# EasyEDA Pro project ProPrj_MN42_v2_2026-01-12.epro, board MOAR_Board
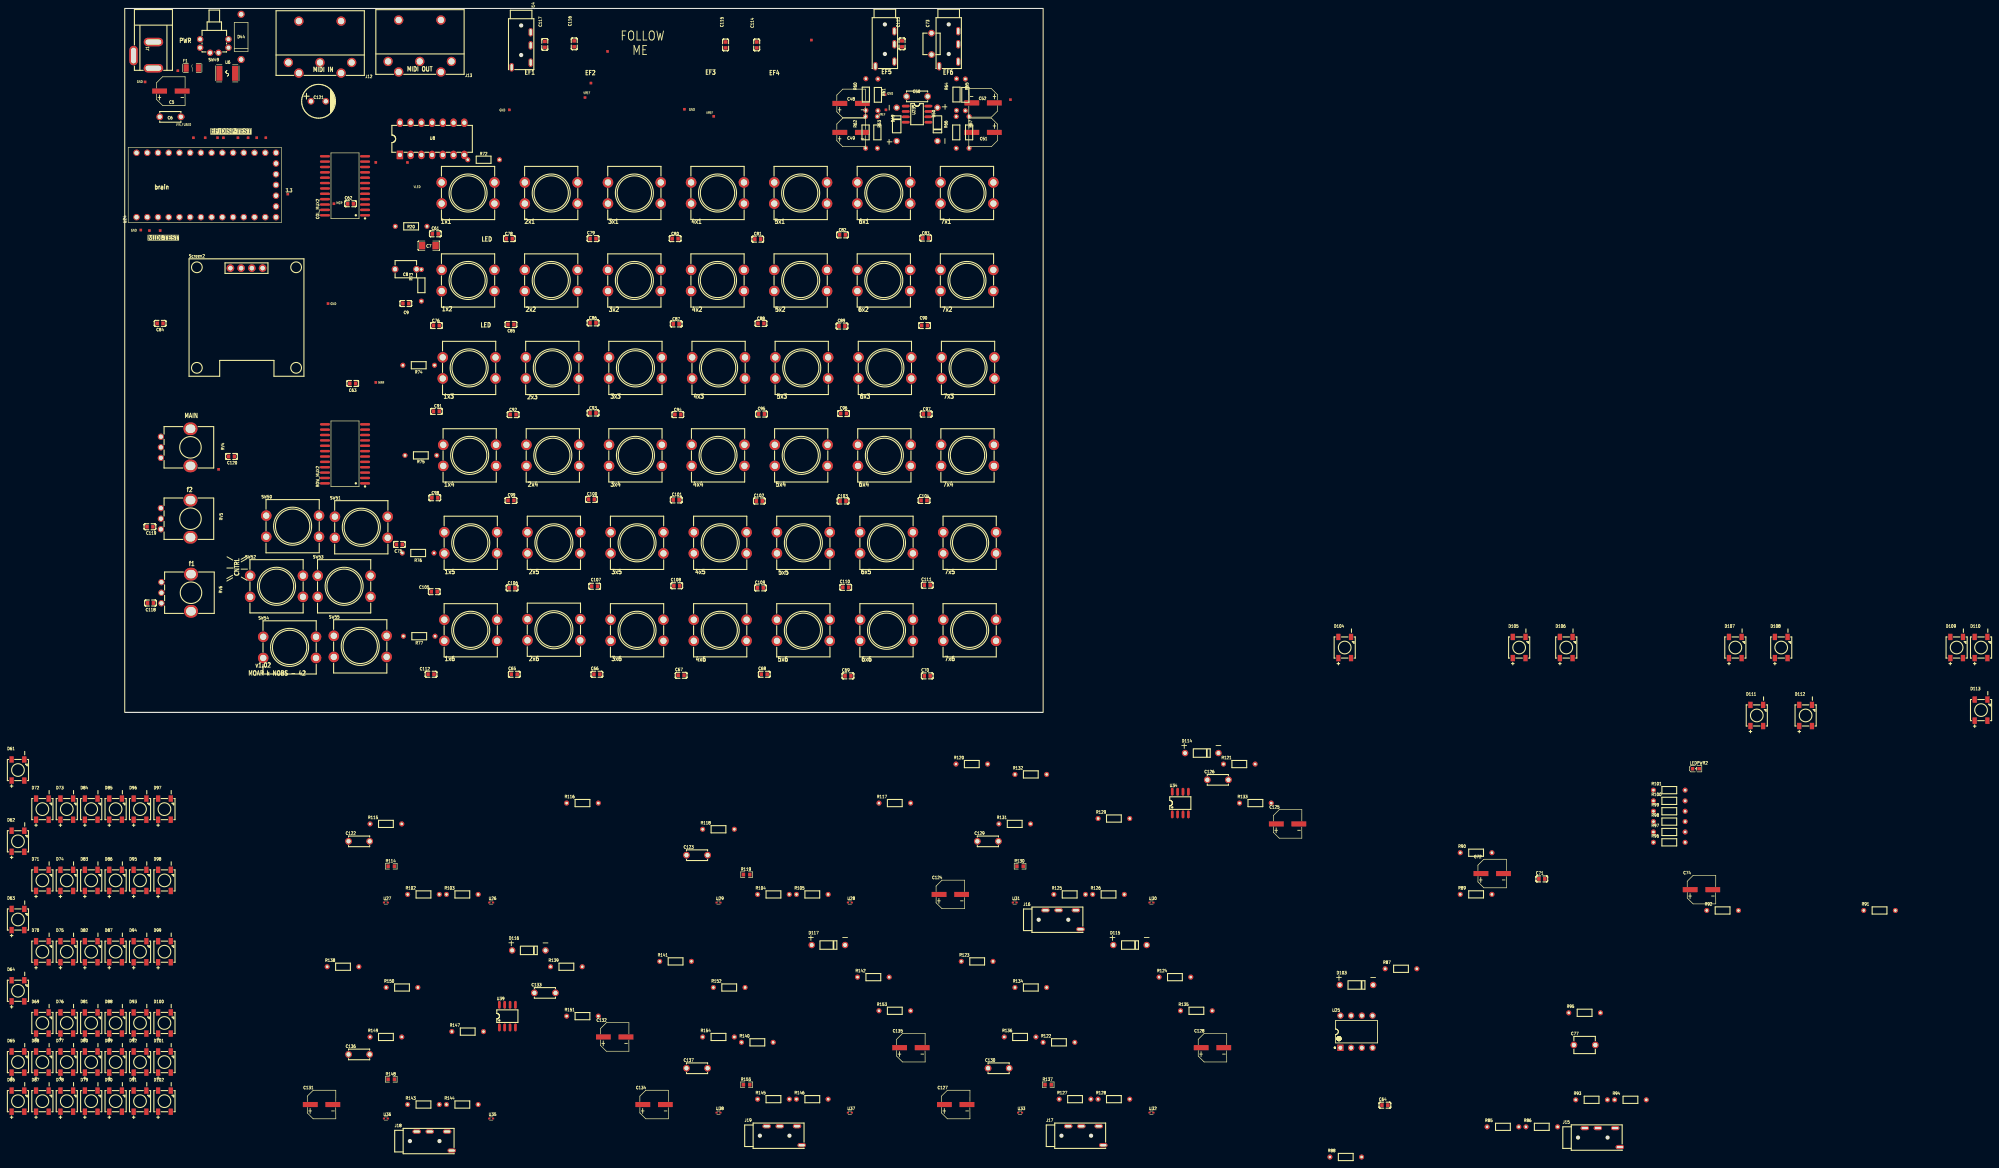
[diagram p3: board, top side]
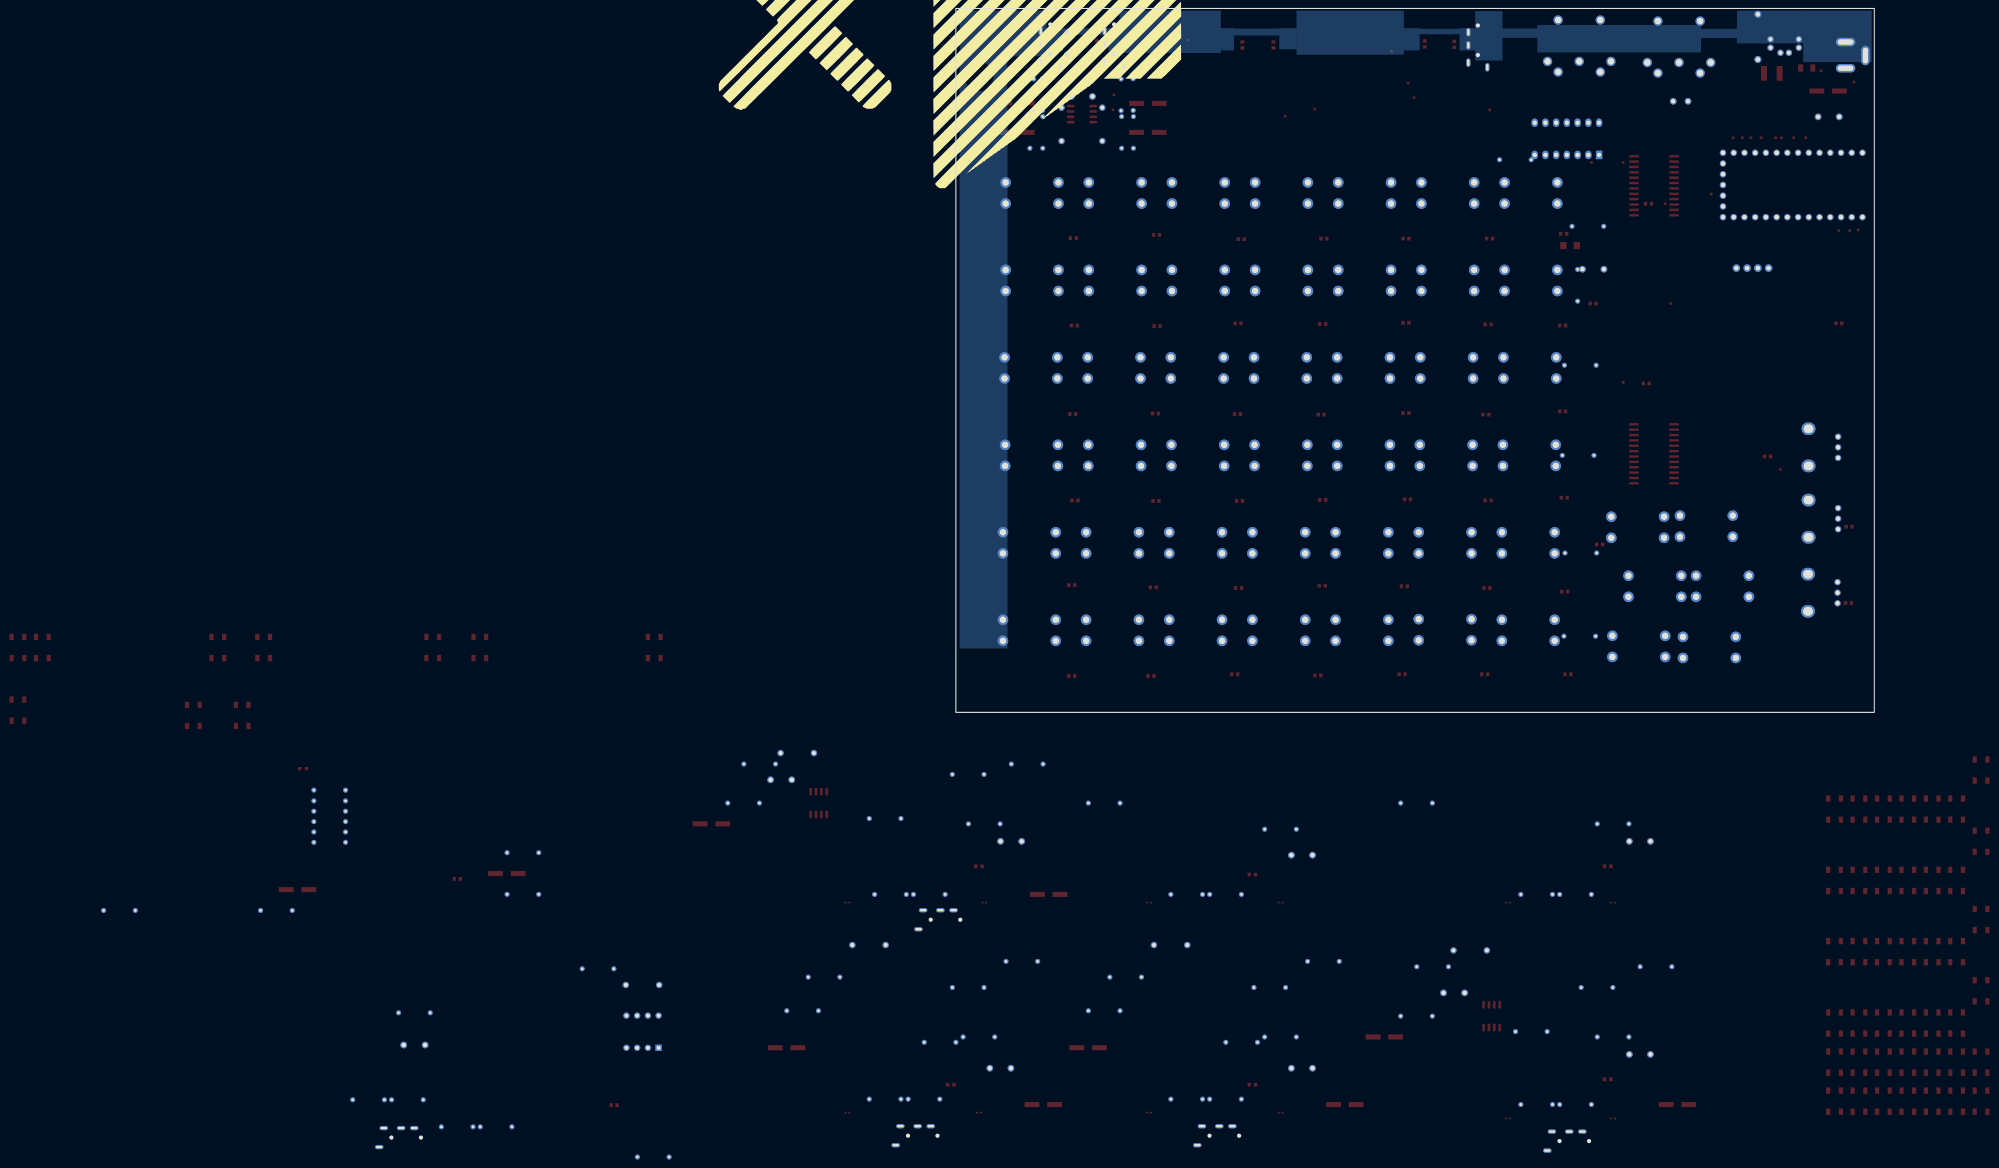
[diagram p4: board, bottom side, seen from below]

Outline 351.54 x 268.6 mm; copper layers: Top Layer, Bottom Layer. Coordinates in mm from the lower left corner of the outline.
Outline path: rectangle 0,268.6 217.42,101.98
Stack: Top Layer 0.035mm / Dielectric1 1.51mm FR4 er 4.5 / Bottom Layer 0.035mm

## Design rules (mm)
template: User Custom Config
spacing safeClearance (default): track to track 0.152, other pairs 0.152 to 0.3
track width trackWidth (default): min 0.152, default 0.254, max 2.54
differential pair differentialPair (default): width min 0.127, default 0.254, max 2.54; gap min 0.152, default 0.152
via viaSize (default): diameter min 0.61, default 0.711, max 10; hole min 0.3, default 0.305, max 5.999

## Placement (name value [footprint] x y rotation side)
C5  220uF  [CAP-SMD_BD6.3-L6.6-W6.6-FD]  10.92 249.04 0 top
C6  100nF  [CAP-TH_L5.0-W2.5-P5.00-D1.0]  10.79 242.95 0 top
C7  100uF  [C1206]  71.99 212.45 0 top
C8  1uF  [CAP-TH_L5.0-W4.0-P5.00-D1.0]  66.55 206.88 180 top
C9  100nF  [C0603]  66.55 198.75 180 top
C48  1uF  [CAP-SMD_BD6.3-L6.6-W6.6-FD]  171.96 246.12 0 top
C49  1uF  [CAP-SMD_BD6.3-L6.6-W6.6-FD]  171.96 239.26 0 top
C50  100nF  [CAP-TH_L5.0-W2.5-P5.00-D1.0]  187.58 247.77 180 top
C51  1uF  [CAP-SMD_BD6.3-L6.6-W6.6-FD]  203.2 239.26 180 top
C52  1uF  [CAP-SMD_BD6.3-L6.6-W6.6-FD]  203.2 246.25 180 top
C61  100nF  [C0603]  73.53 215.26 0 top
C62  100nF  [C0603]  53.47 222.37 0 top
C63  100nF  [C0603]  53.97 179.83 0 top
C64  100nF  [C0603]  298.33 8.99 0 top
C65  100nF  [C0603]  92.22 110.99 0 top
C66  100nF  [C0603]  111.78 110.99 0 top
C67  100nF  [C0603]  131.72 110.74 0 top
C68  100nF  [C0603]  151.41 110.99 0 top
C69  100nF  [C0603]  171.22 110.61 0 top
C70  100nF  [C0603]  189.99 110.61 0 top
C71  100nF  [C0603]  335.47 62.55 0 top
C72  4.7uF  [CAP-SMD_BD6.3-L6.6-W6.6-FD]  323.73 63.82 0 top
C73  1uF  [CAP-TH_L5.0-W4.0-P5.00-D1.0]  191.01 260.22 270 top
C74  10uF  [CAP-SMD_BD6.3-L6.6-W6.6-FD]  373.28 60.01 0 top
C75  100nF  [C0603]  65.02 141.73 0 top
C76  100nF  [C0603]  73.79 193.54 0 top
C77  4.7nF  [CAP-TH_L5.0-W4.0-P5.00-D1.0]  345.61 23.24 0 top
C78  100nF  [C0603]  91.06 214.12 0 top
C79  100nF  [C0603]  110.87 214.12 0 top
C80  100nF  [C0603]  130.3 214.12 180 top
C81  100nF  [C0603]  149.86 213.99 180 top
C82  100nF  [C0603]  169.93 215.01 180 top
C83  100nF  [C0603]  189.61 214.24 180 top
C84  100nF  [C0603]  8.38 194.05 0 top
C85  100nF  [C0603]  91.44 193.8 0 top
C86  100nF  [C0603]  110.87 194.18 0 top
C87  100nF  [C0603]  130.56 193.92 0 top
C88  100nF  [C0603]  150.62 194.05 0 top
C89  100nF  [C0603]  169.8 193.42 0 top
C90  100nF  [C0603]  189.36 193.54 0 top
C91  100nF  [C0603]  73.79 173.22 0 top
C92  100nF  [C0603]  91.95 172.46 0 top
C93  100nF  [C0603]  110.87 172.84 0 top
C94  100nF  [C0603]  130.94 172.46 0 top
C95  100nF  [C0603]  150.75 172.59 0 top
C96  100nF  [C0603]  170.18 172.71 0 top
C97  100nF  [C0603]  189.74 172.59 0 top
C98  100nF  [C0603]  73.41 152.78 0 top
C99  100nF  [C0603]  91.44 152.14 0 top
C100  100nF  [C0603]  110.49 152.39 0 top
C101  100nF  [C0603]  130.56 152.27 0 top
C102  100nF  [C0603]  150.24 152.01 0 top
C103  100nF  [C0603]  170.05 152.01 0 top
C104  100nF  [C0603]  189.23 152.14 0 top
C105  100nF  [C0603]  73.28 130.55 0 top
C106  100nF  [C0603]  91.69 131.44 0 top
C107  100nF  [C0603]  111.25 131.82 0 top
C108  100nF  [C0603]  130.68 131.95 0 top
C109  100nF  [C0603]  150.5 131.44 0 top
C110  100nF  [C0603]  170.69 131.57 0 top
C111  100nF  [C0603]  189.99 132.07 0 top
C112  100nF  [C0603]  72.52 110.99 0 top
C113  100nF  [C0603]  184.02 260.22 270 top
C114  100nF  [C0603]  149.61 259.96 270 top
C115  100nF  [C0603]  142.24 259.96 270 top
C116  100nF  [C0603]  106.43 260.22 270 top
C117  100nF  [C0603]  99.44 260.09 270 top
C118  100nF  [C0603]  6.1 127.86 0 top
C119  100nF  [C0603]  5.97 145.92 0 top
C120  100nF  [C0603]  25.27 162.55 0 top
C121  1000uF  [CAP-TH_BD8.0-P3.50-D0.6-FD]  45.85 246.63 0 top
C122  2.2uF  [CAP-TH_L5.0-W2.5-P5.00-D1.0]  55.49 71.45 0 top
C123  2.2uF  [CAP-TH_L5.0-W2.5-P5.00-D1.0]  135.49 68.18 0 top
C124  1uF  [CAP-SMD_BD6.3-L6.6-W6.6-FD]  195.45 58.88 0 top
C125  1uF  [CAP-SMD_BD6.3-L6.6-W6.6-FD]  275.29 75.57 0 top
C126  100nF  [CAP-TH_L5.0-W2.5-P5.00-D1.0]  258.78 86.02 0 top
C127  1uF  [CAP-SMD_BD6.3-L6.6-W6.6-FD]  196.72 9.15 0 top
C128  1uF  [CAP-SMD_BD6.3-L6.6-W6.6-FD]  257.51 22.6 0 top
C129  2.2uF  [CAP-TH_L5.0-W2.5-P5.00-D1.0]  204.34 71.45 0 top
C130  2.2uF  [CAP-TH_L5.0-W2.5-P5.00-D1.0]  206.88 17.74 0 top
C131  1uF  [CAP-SMD_BD6.3-L6.6-W6.6-FD]  46.6 9.15 0 top
C132  1uF  [CAP-SMD_BD6.3-L6.6-W6.6-FD]  115.99 25.14 0 top
C133  100nF  [CAP-TH_L5.0-W2.5-P5.00-D1.0]  99.48 35.58 0 top
C134  1uF  [CAP-SMD_BD6.3-L6.6-W6.6-FD]  125.33 9.15 0 top
C135  1uF  [CAP-SMD_BD6.3-L6.6-W6.6-FD]  186.11 22.6 0 top
C136  2.2uF  [CAP-TH_L5.0-W2.5-P5.00-D1.0]  55.49 21.01 0 top
C137  2.2uF  [CAP-TH_L5.0-W2.5-P5.00-D1.0]  135.49 17.74 0 top
COL_MUX2  CD74HC4067M96  [SOIC-24_L15.4-W7.5-P1.27-LS10.3-BL]  52.15 226.63 90 top
D44  SA6.0A  [DO-15_BD3.1-L6.7-P10.70-D0.8-RD]  27.56 261.87 90 top
D49  1N4148PF  [DO-35_BD1.9-L3.9-P7.90-D0.5-FD]  182.75 241.17 90 top
D50  1N4148PF  [DO-35_BD1.9-L3.9-P7.90-D0.5-FD]  192.41 241.17 270 top
D61  XL-5050RGBC-WS2812B  [LED-SMD_4P-L5.0-W5.0-BL_XL-5050RGBC]  -25.28 88.33 0 top
D62  XL-5050RGBC-WS2812B  [LED-SMD_4P-L5.0-W5.0-BL_XL-5050RGBC]  -25.28 71.45 0 top
D63  XL-5050RGBC-WS2812B  [LED-SMD_4P-L5.0-W5.0-BL_XL-5050RGBC]  -25.28 52.94 0 top
D64  XL-5050RGBC-WS2812B  [LED-SMD_4P-L5.0-W5.0-BL_XL-5050RGBC]  -25.28 36.07 0 top
D65  XL-5050RGBC-WS2812B  [LED-SMD_4P-L5.0-W5.0-BL_XL-5050RGBC]  -25.28 19.2 0 top
D66  XL-5050RGBC-WS2812B  [LED-SMD_4P-L5.0-W5.0-BL_XL-5050RGBC]  -25.28 9.94 0 top
D67  XL-5050RGBC-WS2812B  [LED-SMD_4P-L5.0-W5.0-BL_XL-5050RGBC]  -19.5 9.94 0 top
D68  XL-5050RGBC-WS2812B  [LED-SMD_4P-L5.0-W5.0-BL_XL-5050RGBC]  -19.5 19.2 0 top
D69  XL-5050RGBC-WS2812B  [LED-SMD_4P-L5.0-W5.0-BL_XL-5050RGBC]  -19.5 28.45 0 top
D70  XL-5050RGBC-WS2812B  [LED-SMD_4P-L5.0-W5.0-BL_XL-5050RGBC]  -19.5 45.32 0 top
D71  XL-5050RGBC-WS2812B  [LED-SMD_4P-L5.0-W5.0-BL_XL-5050RGBC]  -19.5 62.2 0 top
D72  XL-5050RGBC-WS2812B  [LED-SMD_4P-L5.0-W5.0-BL_XL-5050RGBC]  -19.5 79.07 0 top
D73  XL-5050RGBC-WS2812B  [LED-SMD_4P-L5.0-W5.0-BL_XL-5050RGBC]  -13.72 79.07 0 top
D74  XL-5050RGBC-WS2812B  [LED-SMD_4P-L5.0-W5.0-BL_XL-5050RGBC]  -13.72 62.2 0 top
D75  XL-5050RGBC-WS2812B  [LED-SMD_4P-L5.0-W5.0-BL_XL-5050RGBC]  -13.72 45.32 0 top
D76  XL-5050RGBC-WS2812B  [LED-SMD_4P-L5.0-W5.0-BL_XL-5050RGBC]  -13.72 28.45 0 top
D77  XL-5050RGBC-WS2812B  [LED-SMD_4P-L5.0-W5.0-BL_XL-5050RGBC]  -13.72 19.2 0 top
D78  XL-5050RGBC-WS2812B  [LED-SMD_4P-L5.0-W5.0-BL_XL-5050RGBC]  -13.72 9.94 0 top
D79  XL-5050RGBC-WS2812B  [LED-SMD_4P-L5.0-W5.0-BL_XL-5050RGBC]  -7.94 9.94 0 top
D80  XL-5050RGBC-WS2812B  [LED-SMD_4P-L5.0-W5.0-BL_XL-5050RGBC]  -7.94 19.2 0 top
D81  XL-5050RGBC-WS2812B  [LED-SMD_4P-L5.0-W5.0-BL_XL-5050RGBC]  -7.94 28.45 0 top
D82  XL-5050RGBC-WS2812B  [LED-SMD_4P-L5.0-W5.0-BL_XL-5050RGBC]  -7.94 45.32 0 top
D83  XL-5050RGBC-WS2812B  [LED-SMD_4P-L5.0-W5.0-BL_XL-5050RGBC]  -7.94 62.2 0 top
D84  XL-5050RGBC-WS2812B  [LED-SMD_4P-L5.0-W5.0-BL_XL-5050RGBC]  -7.94 79.07 0 top
D85  XL-5050RGBC-WS2812B  [LED-SMD_4P-L5.0-W5.0-BL_XL-5050RGBC]  -2.16 79.07 0 top
D86  XL-5050RGBC-WS2812B  [LED-SMD_4P-L5.0-W5.0-BL_XL-5050RGBC]  -2.16 62.2 0 top
D87  XL-5050RGBC-WS2812B  [LED-SMD_4P-L5.0-W5.0-BL_XL-5050RGBC]  -2.16 45.32 0 top
D88  XL-5050RGBC-WS2812B  [LED-SMD_4P-L5.0-W5.0-BL_XL-5050RGBC]  -2.16 28.45 0 top
D89  XL-5050RGBC-WS2812B  [LED-SMD_4P-L5.0-W5.0-BL_XL-5050RGBC]  -2.16 19.2 0 top
D90  XL-5050RGBC-WS2812B  [LED-SMD_4P-L5.0-W5.0-BL_XL-5050RGBC]  -2.16 9.94 0 top
D91  XL-5050RGBC-WS2812B  [LED-SMD_4P-L5.0-W5.0-BL_XL-5050RGBC]  3.62 9.94 0 top
D92  XL-5050RGBC-WS2812B  [LED-SMD_4P-L5.0-W5.0-BL_XL-5050RGBC]  3.62 19.2 0 top
D93  XL-5050RGBC-WS2812B  [LED-SMD_4P-L5.0-W5.0-BL_XL-5050RGBC]  3.62 28.45 0 top
D94  XL-5050RGBC-WS2812B  [LED-SMD_4P-L5.0-W5.0-BL_XL-5050RGBC]  3.62 45.32 0 top
D95  XL-5050RGBC-WS2812B  [LED-SMD_4P-L5.0-W5.0-BL_XL-5050RGBC]  3.62 62.2 0 top
D96  XL-5050RGBC-WS2812B  [LED-SMD_4P-L5.0-W5.0-BL_XL-5050RGBC]  3.62 79.07 0 top
D97  XL-5050RGBC-WS2812B  [LED-SMD_4P-L5.0-W5.0-BL_XL-5050RGBC]  9.4 79.07 0 top
D98  XL-5050RGBC-WS2812B  [LED-SMD_4P-L5.0-W5.0-BL_XL-5050RGBC]  9.4 62.2 0 top
D99  XL-5050RGBC-WS2812B  [LED-SMD_4P-L5.0-W5.0-BL_XL-5050RGBC]  9.4 45.32 0 top
D100  XL-5050RGBC-WS2812B  [LED-SMD_4P-L5.0-W5.0-BL_XL-5050RGBC]  9.4 28.45 0 top
D101  XL-5050RGBC-WS2812B  [LED-SMD_4P-L5.0-W5.0-BL_XL-5050RGBC]  9.4 19.2 0 top
D102  XL-5050RGBC-WS2812B  [LED-SMD_4P-L5.0-W5.0-BL_XL-5050RGBC]  9.4 9.94 0 top
D103  1N4148PF  [DO-35_BD1.9-L3.9-P7.90-D0.5-FD]  291.6 37.44 0 top
D104  XL-5050RGBC-WS2812B  [LED-SMD_4P-L5.0-W5.0-BL_XL-5050RGBC]  288.82 117.32 0 top
D105  XL-5050RGBC-WS2812B  [LED-SMD_4P-L5.0-W5.0-BL_XL-5050RGBC]  330.11 117.32 0 top
D106  XL-5050RGBC-WS2812B  [LED-SMD_4P-L5.0-W5.0-BL_XL-5050RGBC]  341.26 117.32 0 top
D107  XL-5050RGBC-WS2812B  [LED-SMD_4P-L5.0-W5.0-BL_XL-5050RGBC]  381.29 117.32 0 top
D108  XL-5050RGBC-WS2812B  [LED-SMD_4P-L5.0-W5.0-BL_XL-5050RGBC]  392.15 117.32 0 top
D109  XL-5050RGBC-WS2812B  [LED-SMD_4P-L5.0-W5.0-BL_XL-5050RGBC]  433.68 117.32 0 top
D110  XL-5050RGBC-WS2812B  [LED-SMD_4P-L5.0-W5.0-BL_XL-5050RGBC]  439.46 117.32 0 top
D111  XL-5050RGBC-WS2812B  [LED-SMD_4P-L5.0-W5.0-BL_XL-5050RGBC]  386.37 101.24 0 top
D112  XL-5050RGBC-WS2812B  [LED-SMD_4P-L5.0-W5.0-BL_XL-5050RGBC]  397.93 101.24 0 top
D113  XL-5050RGBC-WS2812B  [LED-SMD_4P-L5.0-W5.0-BL_XL-5050RGBC]  439.46 102.51 0 top
D114  1N4148PF  [DO-35_BD1.9-L3.9-P7.90-D0.5-FD]  254.97 92.34 0 top
D115  1N4148PF  [DO-35_BD1.9-L3.9-P7.90-D0.5-FD]  237.98 46.9 0 top
D116  1N4148PF  [DO-35_BD1.9-L3.9-P7.90-D0.5-FD]  95.67 45.63 0 top
D117  1N4148PF  [DO-35_BD1.9-L3.9-P7.90-D0.5-FD]  166.59 46.9 0 top
F1  nSMD050-33V  [F1206]  16 254.5 0 top
J1  DC005  [DC-IN-TH_DC005]  4.45 257.55 270 top
J8  HC-PJ-320A  [AUDIO-SMD_HC-PJ-320A]  179.96 259.07 270 top
J9  HC-PJ-320A  [AUDIO-SMD_HC-PJ-320A]  195.07 259.07 270 top
J12  DIN-504B-M10  [CONN-TH_DIN-504B-M10]  46.23 259.46 180 top
J13  DIN-504B-M10  [CONN-TH_DIN-504B-M10]  69.85 259.71 180 top
J14  HC-PJ-320A  [AUDIO-SMD_HC-PJ-320A]  93.85 258.82 270 top
J15  HC-PJ-320A  [AUDIO-SMD_HC-PJ-320A]  349.8 1.33 0 top
J16  HC-PJ-320A  [AUDIO-SMD_HC-PJ-320A]  222.12 52.89 0 top
J17  HC-PJ-320A  [AUDIO-SMD_HC-PJ-320A]  227.51 1.77 0 top
J18  HC-PJ-320A  [AUDIO-SMD_HC-PJ-320A]  73.27 0.5 0 top
J19  HC-PJ-320A  [AUDIO-SMD_HC-PJ-320A]  156.12 1.77 0 top
LEDPWR2  -  [LED_0603]  372.01 88.64 0 top
NOREF  -  [Pad_e6019]  19.05 237.99 0 top
NOREF#2  -  [Pad_e371]  114.3 258.44 0 top
NOREF#3  -  [Pad_e726]  132.5 244.74 180 top
NOREF#4  -  [Pad_e954935]  110.36 250.95 0 top
NOREF#5  -  [Pad_e146]  12.57 253.87 0 top
NOREF#6  -  [Pad_e954570]  3.81 216.15 0 top
NOREF#7  -  [Pad_e372]  162.56 261.11 0 top
NOREF#8  -  [Pad_e954937]  59.44 232.15 0 top
NOREF#9  -  [Pad_e222]  108.97 247.52 0 top
NOREF#10  -  [Pad_e236]  59.44 180.08 0 top
NOREF#11  -  [Pad_e6022]  31.24 237.99 0 top
NOREF#12  -  [Pad_e6035]  21.97 237.99 0 top
NOREF#13  -  [Pad_e234]  49.53 222.37 0 top
NOREF#14  -  [Pad_e215]  38.61 224.66 0 top
NOREF#15  -  [Pad_e370]  22.22 159.51 0 top
NOREF#16  -  [Pad_e373]  209.68 247.01 0 top
NOREF#17  -  [Pad_e6015]  8.38 216.02 0 top
NOREF#18  -  [Pad_e6029]  16.26 237.99 0 top
NOREF#19  -  [Pad_e6013]  5.84 216.02 0 top
NOREF#20  -  [Pad_e223]  139.45 243.07 0 top
NOREF#21  -  [Pad_e229]  185.46 247.42 0 top
NOREF#22  -  [Pad_e6017]  66.93 232.15 0 top
NOREF#23  -  [Pad_e6036]  23.37 237.99 0 top
NOREF#24  -  [Pad_e6023]  33.4 237.99 0 top
NOREF#25  -  [Pad_e6020]  26.8 237.99 0 top
NOREF#26  -  [Pad_e730]  180 248.17 180 top
NOREF#27  -  [Pad_e954575]  4.83 251.2 0 top
NOREF#28  -  [Pad_e213]  13.84 242.95 0 top
NOREF#29  -  [Pad_e6021]  29.21 237.99 0 top
NOREF#30  -  [Pad_e724]  91.06 244.6 0 top
NOREF#31  -  [Pad_e954561]  48.13 198.75 0 top
NOREF#32  -  [Pad_e955723]  180.21 244.6 0 top
R20  33Ω  [RES-TH_BD1.7-L3.5-P7.50-D0.5]  67.8 217.02 0 top
R60  100kΩ  [RES-TH_BD1.7-L3.5-P7.50-D0.5]  175.45 248.22 90 top
R61  100kΩ  [RES-TH_BD1.7-L3.5-P7.50-D0.5]  178.31 248.15 90 top
R62  22kΩ  [RES-TH_BD1.7-L3.5-P7.50-D0.5]  175.39 239.26 90 top
R63  10kΩ  [RES-TH_BD1.7-L3.5-P7.50-D0.5]  178.18 239.26 90 top
R64  100kΩ  [RES-TH_BD1.7-L3.5-P7.50-D0.5]  196.91 248.22 90 top
R65  100kΩ  [RES-TH_BD1.7-L3.5-P7.50-D0.5]  199.01 248.15 90 top
R66  22kΩ  [RES-TH_BD1.7-L3.5-P7.50-D0.5]  196.85 239.26 90 top
R67  10kΩ  [RES-TH_BD1.7-L3.5-P7.50-D0.5]  199.9 239.26 90 top
R72  10kΩ  [RES-TH_BD1.7-L3.5-P7.50-D0.5]  84.96 232.79 0 top
R73  10kΩ  [RES-TH_BD1.7-L3.5-P7.50-D0.5]  70.23 203.07 270 top
R74  10kΩ  [RES-TH_BD1.7-L3.5-P7.50-D0.5]  69.6 184.14 0 top
R75  10kΩ  [RES-TH_BD1.7-L3.5-P7.50-D0.5]  70.1 162.81 0 top
R76  10kΩ  [RES-TH_BD1.7-L3.5-P7.50-D0.5]  69.47 139.69 0 top
R77  10kΩ  [RES-TH_BD1.7-L3.5-P7.50-D0.5]  69.72 120.01 0 top
R85  220Ω  [RES-TH_BD1.7-L3.5-P7.50-D0.5]  326.27 3.87 0 top
R86  220Ω  [RES-TH_BD1.7-L3.5-P7.50-D0.5]  335.47 3.87 0 top
R87  220Ω  [RES-TH_BD1.7-L3.5-P7.50-D0.5]  302.14 41.28 0 top
R88  4.7kΩ  [RES-TH_BD1.7-L3.5-P7.50-D0.5]  289.06 -3.28 0 top
R89  100kΩ  [RES-TH_BD1.7-L3.5-P7.50-D0.5]  319.92 58.9 0 top
R90  100kΩ  [RES-TH_BD1.7-L3.5-P7.50-D0.5]  319.92 68.75 0 top
R91  4.7kΩ  [RES-TH_BD1.7-L3.5-P7.50-D0.5]  415.43 55.09 0 top
R92  4.7kΩ  [RES-TH_BD1.7-L3.5-P7.50-D0.5]  378.27 55.09 0 top
R93  220Ω  [RES-TH_BD1.7-L3.5-P7.50-D0.5]  347.26 10.26 0 top
R94  220Ω  [RES-TH_BD1.7-L3.5-P7.50-D0.5]  356.46 10.26 0 top
R95  220Ω  [RES-TH_BD1.7-L3.5-P7.50-D0.5]  345.61 30.86 0 top
R96  220Ω  [RES-TH_BD1.7-L3.5-P7.50-D0.5]  365.66 71.21 0 top
R97  220Ω  [RES-TH_BD1.7-L3.5-P7.50-D0.5]  365.66 73.66 0 top
R98  220Ω  [RES-TH_BD1.7-L3.5-P7.50-D0.5]  365.66 76.12 0 top
R99  220Ω  [RES-TH_BD1.7-L3.5-P7.50-D0.5]  365.66 78.57 0 top
R100  220Ω  [RES-TH_BD1.7-L3.5-P7.50-D0.5]  365.66 81.02 0 top
R101  220Ω  [RES-TH_BD1.7-L3.5-P7.50-D0.5]  365.66 83.56 0 top
R102  1kΩ  [RES-TH_BD1.7-L3.5-P7.50-D0.5]  70.73 58.88 0 top
R103  1kΩ  [RES-TH_BD1.7-L3.5-P7.50-D0.5]  79.93 58.88 0 top
R104  1kΩ  [RES-TH_BD1.7-L3.5-P7.50-D0.5]  153.58 58.88 0 top
R105  1kΩ  [RES-TH_BD1.7-L3.5-P7.50-D0.5]  162.78 58.88 0 top
R114  4.7KΩ  [R0603]  63.11 65.54 0 top
R115  100kΩ  [RES-TH_BD1.7-L3.5-P7.50-D0.5]  61.84 75.57 0 top
R116  68Ω  [RES-TH_BD1.7-L3.5-P7.50-D0.5]  108.37 80.5 0 top
R117  68Ω  [RES-TH_BD1.7-L3.5-P7.50-D0.5]  182.3 80.5 0 top
R118  100kΩ  [RES-TH_BD1.7-L3.5-P7.50-D0.5]  140.57 74.3 0 top
R119  4.7K  [R0603]  147.23 63.57 0 top
R120  100kΩ  [RES-TH_BD1.7-L3.5-P7.50-D0.5]  200.53 89.74 0 top
R121  22kΩ  [RES-TH_BD1.7-L3.5-P7.50-D0.5]  263.86 89.74 0 top
R122  100kΩ  [RES-TH_BD1.7-L3.5-P7.50-D0.5]  221.16 23.87 0 top
R123  100kΩ  [RES-TH_BD1.7-L3.5-P7.50-D0.5]  201.8 43.03 0 top
R124  22kΩ  [RES-TH_BD1.7-L3.5-P7.50-D0.5]  248.62 39.3 0 top
R125  1kΩ  [RES-TH_BD1.7-L3.5-P7.50-D0.5]  223.7 58.88 0 top
R126  1kΩ  [RES-TH_BD1.7-L3.5-P7.50-D0.5]  232.91 58.88 0 top
R127  1kΩ  [RES-TH_BD1.7-L3.5-P7.50-D0.5]  224.97 10.42 0 top
R128  1kΩ  [RES-TH_BD1.7-L3.5-P7.50-D0.5]  234.17 10.42 0 top
R129  100kΩ  [RES-TH_BD1.7-L3.5-P7.50-D0.5]  234.17 76.84 0 top
R130  4.7KΩ  [R0603]  211.96 65.54 0 top
R131  100kΩ  [RES-TH_BD1.7-L3.5-P7.50-D0.5]  210.69 75.57 0 top
R132  10kΩ  [RES-TH_BD1.7-L3.5-P7.50-D0.5]  214.5 87.29 0 top
R133  68Ω  [RES-TH_BD1.7-L3.5-P7.50-D0.5]  267.67 80.5 0 top
R134  10kΩ  [RES-TH_BD1.7-L3.5-P7.50-D0.5]  214.5 36.85 0 top
R135  68Ω  [RES-TH_BD1.7-L3.5-P7.50-D0.5]  253.7 31.34 0 top
R136  100kΩ  [RES-TH_BD1.7-L3.5-P7.50-D0.5]  211.96 25.14 0 top
R137  4.7K  [R0603]  218.62 13.84 0 top
R138  100kΩ  [RES-TH_BD1.7-L3.5-P7.50-D0.5]  51.68 41.76 0 top
R139  22kΩ  [RES-TH_BD1.7-L3.5-P7.50-D0.5]  104.56 41.76 0 top
R140  100kΩ  [RES-TH_BD1.7-L3.5-P7.50-D0.5]  149.77 23.87 0 top
R141  100kΩ  [RES-TH_BD1.7-L3.5-P7.50-D0.5]  130.41 43.03 0 top
R142  22kΩ  [RES-TH_BD1.7-L3.5-P7.50-D0.5]  177.22 39.3 0 top
R143  1kΩ  [RES-TH_BD1.7-L3.5-P7.50-D0.5]  70.73 9.15 0 top
R144  1kΩ  [RES-TH_BD1.7-L3.5-P7.50-D0.5]  79.93 9.15 0 top
R145  1kΩ  [RES-TH_BD1.7-L3.5-P7.50-D0.5]  153.58 10.42 0 top
R146  1kΩ  [RES-TH_BD1.7-L3.5-P7.50-D0.5]  162.78 10.42 0 top
R147  100kΩ  [RES-TH_BD1.7-L3.5-P7.50-D0.5]  81.2 26.41 0 top
R148  4.7KΩ  [R0603]  63.11 15.11 0 top
R149  100kΩ  [RES-TH_BD1.7-L3.5-P7.50-D0.5]  61.84 25.14 0 top
R150  10kΩ  [RES-TH_BD1.7-L3.5-P7.50-D0.5]  65.65 36.85 0 top
R151  68Ω  [RES-TH_BD1.7-L3.5-P7.50-D0.5]  108.37 30.07 0 top
R152  10kΩ  [RES-TH_BD1.7-L3.5-P7.50-D0.5]  143.11 36.85 0 top
R153  68Ω  [RES-TH_BD1.7-L3.5-P7.50-D0.5]  182.3 31.34 0 top
R154  100kΩ  [RES-TH_BD1.7-L3.5-P7.50-D0.5]  140.57 25.14 0 top
R155  4.7K  [R0603]  147.23 13.84 0 top
ROW_MUX2  CD74HC4067M96  [SOIC-24_L15.4-W7.5-P1.27-LS10.3-BL]  52.15 163.18 90 top
RV4  10kΩ  [RES-ADJ-TH_RK09K1130A5R]  12.06 164.71 270 top
RV5  10kΩ  [RES-ADJ-TH_RK09K1130A5R]  12.06 147.82 270 top
RV6  10kΩ  [RES-ADJ-TH_RK09K1130A5R]  12.19 130.3 270 top
Screen2  HS96L03W2C03  [OLED-TH_L27.8-W27.2-P2.54_C9900033791]  28.83 207.13 0 top
SW1  HX B3F-4055-Y  [SW-TH_4P-L12.0-W12.0-P5.00-LS12.5]  81.28 224.91 180 top
SW2  HX B3F-4055-Y  [SW-TH_4P-L12.0-W12.0-P5.00-LS12.5]  100.97 224.91 180 top
SW3  HX B3F-4055-Y  [SW-TH_4P-L12.0-W12.0-P5.00-LS12.5]  120.65 224.91 180 top
SW4  HX B3F-4055-Y  [SW-TH_4P-L12.0-W12.0-P5.00-LS12.5]  140.34 224.91 180 top
SW5  HX B3F-4055-Y  [SW-TH_4P-L12.0-W12.0-P5.00-LS12.5]  160.02 224.91 180 top
SW6  HX B3F-4055-Y  [SW-TH_4P-L12.0-W12.0-P5.00-LS12.5]  179.7 224.91 180 top
SW7  HX B3F-4055-Y  [SW-TH_4P-L12.0-W12.0-P5.00-LS12.5]  199.39 224.91 180 top
SW8  HX B3F-4055-Y  [SW-TH_4P-L12.0-W12.0-P5.00-LS12.5]  81.28 204.21 180 top
SW9  HX B3F-4055-Y  [SW-TH_4P-L12.0-W12.0-P5.00-LS12.5]  100.97 204.21 180 top
SW10  HX B3F-4055-Y  [SW-TH_4P-L12.0-W12.0-P5.00-LS12.5]  120.65 204.21 180 top
SW11  HX B3F-4055-Y  [SW-TH_4P-L12.0-W12.0-P5.00-LS12.5]  140.34 204.21 180 top
SW12  HX B3F-4055-Y  [SW-TH_4P-L12.0-W12.0-P5.00-LS12.5]  160.02 204.21 180 top
SW13  HX B3F-4055-Y  [SW-TH_4P-L12.0-W12.0-P5.00-LS12.5]  179.7 204.21 180 top
SW14  HX B3F-4055-Y  [SW-TH_4P-L12.0-W12.0-P5.00-LS12.5]  199.39 204.21 180 top
SW15  HX B3F-4055-Y  [SW-TH_4P-L12.0-W12.0-P5.00-LS12.5]  81.53 183.51 180 top
SW16  HX B3F-4055-Y  [SW-TH_4P-L12.0-W12.0-P5.00-LS12.5]  101.22 183.51 180 top
SW17  HX B3F-4055-Y  [SW-TH_4P-L12.0-W12.0-P5.00-LS12.5]  120.9 183.51 180 top
SW18  HX B3F-4055-Y  [SW-TH_4P-L12.0-W12.0-P5.00-LS12.5]  140.59 183.51 180 top
SW19  HX B3F-4055-Y  [SW-TH_4P-L12.0-W12.0-P5.00-LS12.5]  160.27 183.51 180 top
SW20  HX B3F-4055-Y  [SW-TH_4P-L12.0-W12.0-P5.00-LS12.5]  179.96 183.51 180 top
SW21  HX B3F-4055-Y  [SW-TH_4P-L12.0-W12.0-P5.00-LS12.5]  199.64 183.51 180 top
SW22  HX B3F-4055-Y  [SW-TH_4P-L12.0-W12.0-P5.00-LS12.5]  81.66 162.81 180 top
SW23  HX B3F-4055-Y  [SW-TH_4P-L12.0-W12.0-P5.00-LS12.5]  101.35 162.81 180 top
SW24  HX B3F-4055-Y  [SW-TH_4P-L12.0-W12.0-P5.00-LS12.5]  120.9 162.81 180 top
SW25  HX B3F-4055-Y  [SW-TH_4P-L12.0-W12.0-P5.00-LS12.5]  140.46 162.81 180 top
SW26  HX B3F-4055-Y  [SW-TH_4P-L12.0-W12.0-P5.00-LS12.5]  160.15 162.81 180 top
SW27  HX B3F-4055-Y  [SW-TH_4P-L12.0-W12.0-P5.00-LS12.5]  179.83 162.81 180 top
SW28  HX B3F-4055-Y  [SW-TH_4P-L12.0-W12.0-P5.00-LS12.5]  199.52 162.81 180 top
SW29  HX B3F-4055-Y  [SW-TH_4P-L12.0-W12.0-P5.00-LS12.5]  81.91 142.11 180 top
SW30  HX B3F-4055-Y  [SW-TH_4P-L12.0-W12.0-P5.00-LS12.5]  101.6 142.11 180 top
SW31  HX B3F-4055-Y  [SW-TH_4P-L12.0-W12.0-P5.00-LS12.5]  121.28 142.11 180 top
SW32  HX B3F-4055-Y  [SW-TH_4P-L12.0-W12.0-P5.00-LS12.5]  140.97 142.11 180 top
SW33  HX B3F-4055-Y  [SW-TH_4P-L12.0-W12.0-P5.00-LS12.5]  160.66 142.11 180 top
SW34  HX B3F-4055-Y  [SW-TH_4P-L12.0-W12.0-P5.00-LS12.5]  180.34 142.11 180 top
SW35  HX B3F-4055-Y  [SW-TH_4P-L12.0-W12.0-P5.00-LS12.5]  200.02 142.11 180 top
SW36  HX B3F-4055-Y  [SW-TH_4P-L12.0-W12.0-P5.00-LS12.5]  81.91 121.41 180 top
SW37  HX B3F-4055-Y  [SW-TH_4P-L12.0-W12.0-P5.00-LS12.5]  101.6 121.53 180 top
SW38  HX B3F-4055-Y  [SW-TH_4P-L12.0-W12.0-P5.00-LS12.5]  121.28 121.41 180 top
SW39  HX B3F-4055-Y  [SW-TH_4P-L12.0-W12.0-P5.00-LS12.5]  140.97 121.41 180 top
SW40  HX B3F-4055-Y  [SW-TH_4P-L12.0-W12.0-P5.00-LS12.5]  160.66 121.41 180 top
SW41  HX B3F-4055-Y  [SW-TH_4P-L12.0-W12.0-P5.00-LS12.5]  180.34 121.41 180 top
SW42  HX B3F-4055-Y  [SW-TH_4P-L12.0-W12.0-P5.00-LS12.5]  200.02 121.41 180 top
SW49  TK-6580A-1  [SW-TH_TK-6580A-1]  21.21 259.71 180 top
SW50  HX B3F-4055-Y  [SW-TH_4P-L12.0-W12.0-P5.00-LS12.5]  39.75 146.04 0 top
SW51  HX B3F-4055-Y  [SW-TH_4P-L12.0-W12.0-P5.00-LS12.5]  56.01 145.79 0 top
SW52  HX B3F-4055-Y  [SW-TH_4P-L12.0-W12.0-P5.00-LS12.5]  35.94 131.82 0 top
SW53  HX B3F-4055-Y  [SW-TH_4P-L12.0-W12.0-P5.00-LS12.5]  51.94 131.82 0 top
SW54  HX B3F-4055-Y  [SW-TH_4P-L12.0-W12.0-P5.00-LS12.5]  39.04 117.35 0 top
SW55  HX B3F-4055-Y  [SW-TH_4P-L12.0-W12.0-P5.00-LS12.5]  55.75 117.6 0 top
U6  1812L200/33GR  [F1812]  24.26 253.23 0 top
U8  SN74AHCT125N  [PDIP-14_L19.3-W6.4-P2.54-LS7.6-BL]  72.77 237.74 0 top
U23  MCP6002DRG  [SOP-8_L4.9-W3.9-P1.27-LS6.0-BL]  187.58 243.58 270 top
U24  Teensy  [teensy 4.0:MODULE_DEV-15583]  19.3 226.82 90 top
U25  6N138  [DIP-8_L9.8-W6.6-P2.54-LS7.6-BL]  291.6 26.38 0 top
U26  ESD9B5.0ST5G  [SOD-923_L0.8-W0.6-LS1.0-BI]  86.75 56.96 0 top
U27  ESD9B5.0ST5G  [SOD-923_L0.8-W0.6-LS1.0-BI]  61.84 56.96 0 top
U28  ESD9B5.0ST5G  [SOD-923_L0.8-W0.6-LS1.0-BI]  171.67 56.96 0 top
U29  ESD9B5.0ST5G  [SOD-923_L0.8-W0.6-LS1.0-BI]  140.57 56.96 0 top
U30  ESD9B5.0ST5G  [SOD-923_L0.8-W0.6-LS1.0-BI]  243.06 56.96 0 top
U31  ESD9B5.0ST5G  [SOD-923_L0.8-W0.6-LS1.0-BI]  210.69 56.96 0 top
U32  ESD9B5.0ST5G  [SOD-923_L0.8-W0.6-LS1.0-BI]  243.06 7.23 0 top
U33  ESD9B5.0ST5G  [SOD-923_L0.8-W0.6-LS1.0-BI]  211.96 7.23 0 top
U34  MCP6002DRG  [SOP-8_L4.9-W3.9-P1.27-LS6.0-BL]  249.89 80.5 0 top
U35  ESD9B5.0ST5G  [SOD-923_L0.8-W0.6-LS1.0-BI]  86.75 5.84 0 top
U36  ESD9B5.0ST5G  [SOD-923_L0.8-W0.6-LS1.0-BI]  61.84 5.84 0 top
U37  ESD9B5.0ST5G  [SOD-923_L0.8-W0.6-LS1.0-BI]  171.67 7.23 0 top
U38  ESD9B5.0ST5G  [SOD-923_L0.8-W0.6-LS1.0-BI]  140.57 7.23 0 top
U39  MCP6002DRG  [SOP-8_L4.9-W3.9-P1.27-LS6.0-BL]  90.59 30.07 0 top

## Footprints (pads in the part's own frame, mm; a bottom-side part is the same pattern mirrored in y, then rotated)
AUDIO-SMD_HC-PJ-320A
  oval 2x1 hole 1.5x0.5: 1(4.15,-2.25) 2(-4.15,2.25) 3(-1.05,2.25) 4(3.05,2.25)
C0603
  rect 0.8x0.9 smd: 1(-0.7,0) 2(0.7,0)
C1206
  rect 1.485x1.728 smd: 1(-1.593,0) 2(1.593,0)
CAP-SMD_BD6.3-L6.6-W6.6-FD
  rect 3.5x1.2 smd: 1(-2.67,0) 2(2.67,0)
CAP-TH_BD8.0-P3.50-D0.6-FD
  round 1.6 hole 1: 1(-1.75,0) 2(1.75,0)
CAP-TH_L5.0-W2.5-P5.00-D1.0
  round 1.6 hole 1: 1(-2.5,0) 2(2.5,0)
CAP-TH_L5.0-W4.0-P5.00-D1.0
  round 1.6 hole 1: 1(-2.54,0) 2(2.54,0)
CONN-TH_DIN-504B-M10
  round 2.2 hole 1.5: 1(-7.5,3.65) 2(-5,6.15) 3(0,3.65) 4(5,6.15) 5(7.5,3.65) 6(-5,-6.15) 7(5,-6.15)
DC-IN-TH_DC005
  oval 2x4.6 hole 1.2x3.7: 1(3.1,2.35) 2(-3.1,2.35)
  oval 4.6x2 hole 3.7x1.2: 3(0.1,-2.35)
DIP-8_L9.8-W6.6-P2.54-LS7.6-BL
  rect 1.5x1.5 hole 0.9: 1(-3.81,-3.81)
  round 1.5 hole 0.9: 2(-1.27,-3.81) 3(1.27,-3.81) 4(3.81,-3.81) 5(3.81,3.81) 6(1.27,3.81) 7(-1.27,3.81) 8(-3.81,3.81)
DO-15_BD3.1-L6.7-P10.70-D0.8-RD
  round 1.7 hole 1.06: 1(-5.35,0) 2(5.35,0)
DO-35_BD1.9-L3.9-P7.90-D0.5-FD
  round 1.524 hole 0.914: 1(-3.95,0) 2(3.95,0)
F1206
  rect 1.19x1.728 smd: 1(-1.445,0) 2(1.445,0)
F1812
  rect 1.407x3.499 smd: 1(-1.853,0) 2(1.853,0)
LED-SMD_4P-L5.0-W5.0-BL_XL-5050RGBC
  rect 1x1.5 smd: 1(-1.5,-2.5) 2(1.5,-2.5) 3(1.5,2.5) 4(-1.5,2.5)
LED_0603
  rect 0.8x0.8 smd: 1(-0.851,-0.01) 2(0.75,-0.005)
OLED-TH_L27.8-W27.2-P2.54_C9900033791
  round 1.8 hole 1.05: 1(-3.81,0) 2(-1.27,0) 3(1.27,0) 4(3.81,0)
Pad_e146
  rect 0.61x0.61 smd: TP2(0,0)
Pad_e213
  rect 0.61x0.61 smd: TP3(0,0)
Pad_e215
  rect 0.61x0.61 smd: TP4(0,0)
Pad_e222
  rect 0.61x0.61 smd: TP5(0,0)
Pad_e223
  rect 0.61x0.61 smd: TP6(0,0)
Pad_e229
  rect 0.61x0.61 smd: TP7(0,0)
Pad_e234
  rect 0.61x0.61 smd: TP8(0,0)
Pad_e236
  rect 0.61x0.61 smd: TP9(0,0)
Pad_e370
  rect 0.61x0.61 smd: TP12(0,0)
Pad_e371
  rect 0.61x0.61 smd: TP12(0,0)
Pad_e372
  rect 0.61x0.61 smd: TP12(0,0)
Pad_e373
  rect 0.61x0.61 smd: TP12(0,0)
Pad_e724
  rect 0.61x0.61 smd: TP2(0,0)
Pad_e726
  rect 0.61x0.61 smd: TP2(0,0)
Pad_e730
  rect 0.61x0.61 smd: TP2(0,0)
Pad_e6013
  rect 0.61x0.61 smd: TP10(0,0)
Pad_e6015
  rect 0.61x0.61 smd: TP11(0,0)
Pad_e6017
  rect 0.61x0.61 smd: TP12(0,0)
Pad_e6019
  rect 0.61x0.61 smd: TP13(0,0)
Pad_e6020
  rect 0.61x0.61 smd: TP14(0,0)
Pad_e6021
  rect 0.61x0.61 smd: TP15(0,0)
Pad_e6022
  rect 0.61x0.61 smd: TP16(0,0)
Pad_e6023
  rect 0.61x0.61 smd: TP17(0,0)
Pad_e6029
  rect 0.61x0.61 smd: TP18(0,0)
Pad_e6035
  rect 0.61x0.61 smd: TP19(0,0)
Pad_e6036
  rect 0.61x0.61 smd: TP20(0,0)
Pad_e954561
  rect 0.61x0.61 smd: TP1(0,0)
Pad_e954570
  rect 0.61x0.61 smd: TP2(0,0)
Pad_e954575
  rect 0.61x0.61 smd: TP3(0,0)
Pad_e954935
  rect 0.61x0.61 smd: TP4(0,0)
Pad_e954937
  rect 0.61x0.61 smd: TP5(0,0)
Pad_e955723
  rect 0.61x0.61 smd: TP6(0,0)
PDIP-14_L19.3-W6.4-P2.54-LS7.6-BL
  rect 1.5x2 hole 1: 1(-7.62,-3.81)
  oval 1.5x2 hole 1: 2(-5.08,-3.81) 3(-2.54,-3.81) 4(0,-3.81) 5(2.54,-3.81) 6(5.08,-3.81) 7(7.62,-3.81) 8(7.62,3.81) 9(5.08,3.81) 10(2.54,3.81) 11(0,3.81) 12(-2.54,3.81) 13(-5.08,3.81) 14(-7.62,3.81)
R0603
  rect 0.806x0.864 smd: 1(-0.753,0) 2(0.753,0)
RES-ADJ-TH_RK09K1130A5R
  round 1.5 hole 1: 1(-2.5,-3.5) 2(0,-3.5) 3(2.5,-3.5)
  oval 3x3.3 hole 2x2.3: 4(4.4,3.5) 5(-4.4,3.5)
RES-TH_BD1.7-L3.5-P7.50-D0.5
  round 1.2 hole 0.6: 1(-3.75,0) 2(3.75,0)
SOD-923_L0.8-W0.6-LS1.0-BI
  rect 0.5x0.4 smd: 1(-0.457,0) 2(0.457,0)
SOIC-24_L15.4-W7.5-P1.27-LS10.3-BL
  oval 0.574x2.388 smd: 1(-6.985,-4.744) 2(-5.715,-4.744) 3(-4.445,-4.744) 4(-3.175,-4.744) 5(-1.905,-4.744) 6(-0.635,-4.744) 7(0.635,-4.744) 8(1.905,-4.744) 9(3.175,-4.744) 10(4.445,-4.744) 11(5.715,-4.744) 12(6.985,-4.744) 13(6.985,4.744) 14(5.715,4.744) 15(4.445,4.744) 16(3.175,4.744) 17(1.905,4.744) 18(0.635,4.744) 19(-0.635,4.744) 20(-1.905,4.744) 21(-3.175,4.744) 22(-4.445,4.744) 23(-5.715,4.744) 24(-6.985,4.744)
SOP-8_L4.9-W3.9-P1.27-LS6.0-BL
  oval 0.63x1.865 smd: 1(-1.905,-2.683) 2(-0.635,-2.683) 3(0.635,-2.683) 4(1.905,-2.683) 5(1.905,2.683) 6(0.635,2.683) 7(-0.635,2.683) 8(-1.905,2.683)
SW-TH_4P-L12.0-W12.0-P5.00-LS12.5
  round 2.5 hole 1.5: 1(-6.25,2.5) 2(6.25,2.5) 3(-6.25,-2.5) 4(6.25,-2.5)
SW-TH_TK-6580A-1
  round 1.524 hole 0.914: 1(3.35,-1.6) 2(3.35,0.4) 3(-3.35,-1.6) 4(-3.35,0.4) 5(1,1.6) 6(-1,1.6)
teensy 4.0:MODULE_DEV-15583
  round 1.53 hole 1.02: 0(-7.62,13.97) 1(-7.62,11.43) 2(-7.62,8.89) 3(-7.62,6.35) 3.3V_1(-2.54,-16.51) 3.3V_2(7.62,11.43) 4(-7.62,3.81) 5(-7.62,1.27) 6(-7.62,-1.27) 7(-7.62,-3.81) 8(-7.62,-6.35) 9(-7.62,-8.89) 10(-7.62,-11.43) 11(-7.62,-13.97) 12(-7.62,-16.51) 13(7.62,-16.51) 14(7.62,-13.97) 15(7.62,-11.43) 16(7.62,-8.89) 17(7.62,-6.35) 18(7.62,-3.81) 19(7.62,-1.27) 20(7.62,1.27) 21(7.62,3.81) 22(7.62,6.35) 23(7.62,8.89) G1(-7.62,16.51) G2(0,-16.51) G3(7.62,13.97) ON-OFF(5.08,-16.51) PGM(2.54,-16.51) VBAT(-5.08,-16.51) VIN(7.62,16.51)

## Nets
As in the schematic, except:
3VDC: C50.2 C62.2 C63.2 C73.1 C74.1 C126.2 C133.2 COL_MUX2.24 D49.1 D114.1 D116.1 NOREF.TP13 NOREF#16.TP12 NOREF#21.TP7 R61.1 R63.2 R65.1 R72.1 R73.1 R74.1 R75.1 R76.1 R77.1 R88.1 R92.1 R120.1 R123.1 R132.2 R138.1 R141.1 R150.2 ROW_MUX2.24 RV4.1 RV5.1 RV6.1 Screen2.2 SW50.2 SW51.2 SW52.2 SW53.2 SW54.2 SW55.2 U23.2 U23.8 U24.3.3V_2 U34.2 U34.8 U39.2 U39.8
GND: C5.1 C6.1 C7.1 C8.2 C9.2 C48.1 C49.2 C50.1 C51.1 C52.1 C61.2 C62.1 C63.1 C64.1 C65.2 C66.2 C67.2 C68.2 C69.2 C70.2 C73.2 C74.2 C75.2 C76.2 C77.1 C78.2 C79.2 C80.2 C81.2 C82.2 C83.2 C84.2 C85.2 C86.2 C87.2 C88.2 C89.2 C90.2 C91.2 C92.2 C93.2 C94.2 C95.2 C96.2 C97.2 C98.2 C99.2 C100.2 C101.2 C102.2 C103.2 C104.2 C105.2 C106.2 C107.2 C108.2 C109.2 C110.2 C111.2 C112.2 C113.2 C114.2 C115.2 C116.2 C117.2 C118.2 C119.2 C120.2 C121.2 C124.1 C125.2 C126.1 C127.1 C128.1 C131.1 C132.2 C133.1 C134.1 C135.1 COL_MUX2.3 COL_MUX2.12 COL_MUX2.15 D44.2 D78.2 D79.4 D109.3 D110.2 D111.2 D111.3 D113.4 J1.2 J1.3 J8.1 J8.4 J9.1 J9.4 J12.2 J13.2 J14.1 J14.3 J15.1 J15.3 J16.1 J16.4 J17.1 J17.4 J18.1 J18.4 J19.1 J19.4 LEDPWR2.1 NOREF#18.TP18 R60.2 R64.2 R122.2 R129.2 R140.2 R147.2 ROW_MUX2.12 ROW_MUX2.15 ROW_MUX2.16 ROW_MUX2.17 ROW_MUX2.18 ROW_MUX2.19 ROW_MUX2.20 ROW_MUX2.21 ROW_MUX2.22 ROW_MUX2.23 RV4.3 RV4.4 RV4.5 RV5.3 RV5.4 RV5.5 RV6.3 RV6.4 RV6.5 Screen2.1 SW49.1 SW49.3 U8.1 U8.4 U8.7 U8.8 U8.9 U8.10 U8.11 U8.12 U8.13 U23.4 U24.G1 U24.G3 U25.5 U25.8 U26.2 U27.1 U28.2 U29.2 U30.2 U31.1 U32.2 U33.2 U34.4 U35.2 U36.1 U37.2 U38.2 U39.4
VIN_FUSED: C5.2 C6.2 D44.1 F1.2 NOREF#28.TP3 SW49.4 SW49.6 U6.1
VIN_RAW: F1.1 J1.1 NOREF#5.TP2
E1: C49.1 NOREF#24.TP17 R96.1 R116.2
E2: C52.2 NOREF#11.TP16 R97.1 R117.2
E3: C125.1 NOREF#29.TP15 R98.1 R133.2
E4: C128.2 NOREF#25.TP14 R99.1 R135.2
E6: C135.2 NOREF#3.TP2 NOREF#4.TP4 NOREF#6.TP2 NOREF#8.TP5 NOREF#26.TP2 NOREF#27.TP3 NOREF#30.TP2 NOREF#31.TP1 R101.1 R153.2
LED: NOREF#22.TP12 U8.2 U24.6
MIDI_RX: NOREF#19.TP10 R88.2 U24.0 U25.6
MIDI_TX: NOREF#17.TP11 U8.5 U24.1
MRR: NOREF#10.TP9 ROW_MUX2.1 U24.22
SCL: NOREF#12.TP19 R91.1 R92.2 Screen2.3 U24.19
SDA: NOREF#23.TP20 R91.2 Screen2.4 U24.18
$4N5610: C114.1 D105.3 D106.1 NOREF#7.TP12
$4N5612: C116.1 D107.3 D108.1 NOREF#2.TP12
$4N5621: C120.1 D111.1 D112.3 NOREF#15.TP12
$5N1584: C122.2 NOREF#9.TP5 NOREF#20.TP6 NOREF#32.TP6 R115.1 U23.3

Pads without a net: D104 1; J12 1 3 6 7; J13 1 3 6 7; SW1 3 4; SW2 3 4; SW3 3 4; SW4 3 4; SW5 3 4; SW6 3 4; SW7 3 4; SW8 3 4; SW9 3 4; SW10 3 4; SW11 3 4; SW12 3 4; SW13 3 4; SW14 3 4; SW15 3 4; SW16 3 4; SW17 3 4; SW18 3 4; SW19 3 4; SW20 3 4; SW21 3 4; SW22 3 4; SW23 3 4; SW24 3 4; SW25 3 4; SW26 3 4; SW27 3 4; SW28 3 4; SW29 3 4; SW30 3 4; SW31 3 4; SW32 3 4; SW33 3 4; SW34 3 4; SW35 3 4; SW36 3 4; SW37 3 4; SW38 3 4; SW39 3 4; SW40 3 4; SW41 3 4; SW42 3 4; SW50 3 4; SW51 3 4; SW52 3 4; SW53 3 4; SW54 3 4; SW55 3 4; U24 12 13 ON-OFF PGM VBAT; U25 1 4

## Copper pours and planes (outline as drawn; the poured copper is in the pictures)
E6 on Bottom Layer: 135.13,263.82 156.84,263.82 156.84,262.21 135.13,262.21
E6 on Bottom Layer: 16.61,268.09 32.51,268.09 32.51,260.34 16.61,260.34
E6 on Bottom Layer: 195.96,268.09 216.53,268.09 216.53,257.3 195.96,257.3
E6 on Bottom Layer: 151.57,263.9 155.65,263.9 155.65,258.66 151.57,258.66
E6 on Bottom Layer: 111.38,268.09 136.78,268.09 136.78,257.68 111.38,257.68
E6 on Bottom Layer: 78.1,263.84 89.06,263.84 89.06,261.65 78.1,261.65
E6 on Bottom Layer: 136.77,263.93 140.85,263.93 140.85,258.94 136.77,258.94
E6 on Bottom Layer: 192.11,263.83 196.21,263.83 196.21,258.58 192.11,258.58
E6 on Bottom Layer: 205.21,248.24 216.53,248.24 216.53,117.09 205.21,117.09
E6 on Bottom Layer: 0.63,268.09 16.82,268.09 16.82,255.9 0.63,255.9
E6 on Bottom Layer: 180.49,263.9 195.96,263.9 195.96,262.35 180.49,262.35
E6 on Bottom Layer: 31.01,263.77 41.97,263.77 41.97,261.59 31.01,261.59
E6 on Bottom Layer: 94.11,263.9 98.19,263.9 98.19,258.66 94.11,258.66
E6 on Bottom Layer: 41.02,264.66 79.76,264.66 79.76,258.19 41.02,258.19
E6 on Bottom Layer: 94.11,263.77 111.43,263.77 111.43,262.5 94.11,262.5
E6 on Bottom Layer: 107.63,263.9 111.71,263.9 111.71,258.66 107.63,258.66
E6 on Bottom Layer: 88.01,267.96 94.49,267.96 94.49,256.28 88.01,256.28
E6 on Bottom Layer: 154.69,268.09 178.69,268.09 178.69,258.06 154.69,258.06
E6 on Bottom Layer: 177.26,263.9 181.36,263.9 181.36,258.65 177.26,258.65
E6 on Bottom Layer: 205.25,258.57 216.53,258.57 216.53,246.25 205.25,246.25

## Text on the board
Document Layer: MOARkNOBS-42
Top Silkscreen Layer: GND | VIN_FUSED | MCR | MRR | VLED | VREF | 3.3 | brain | PWR | f2 | MAIN | f1 | v1.02 | MOAR k NOBS - 42 | MIDI IN | MIDI OUT | 1x1 | 1x2 | 1x3 | 1x4 | 1x5 | 1x6 | LED | EF1 | 2x1 | 2x2 | 2x3 | 2x4 | 2x5 | 2x6 | EF2 | 3x1 | 3x2 | 3x3 | 3x4 | 3x5 | 3x6 | 4x1 | 4x2 | 4x4 | 4x3 | 4x5 | 4x6 | EF3 | EF4 | 5x1 | 5x2 | 5x4 | 5x3 | 5x6 | 5x5 | 6x2 | 6x1 | 6x4 | 6x3 | 6x5 | 6x6 | EF5 | 7x1 | 7x2 | EF6 | 7x4 | 7x3 | 7x5 | 7x6 | \\  |  / / CNTRL / /  |  \\ | FOLLOW / ME | MIDI-TEST | EF/DISP-TEST
